# Altium project LPL_Control_board_Rev3.PrjPcb
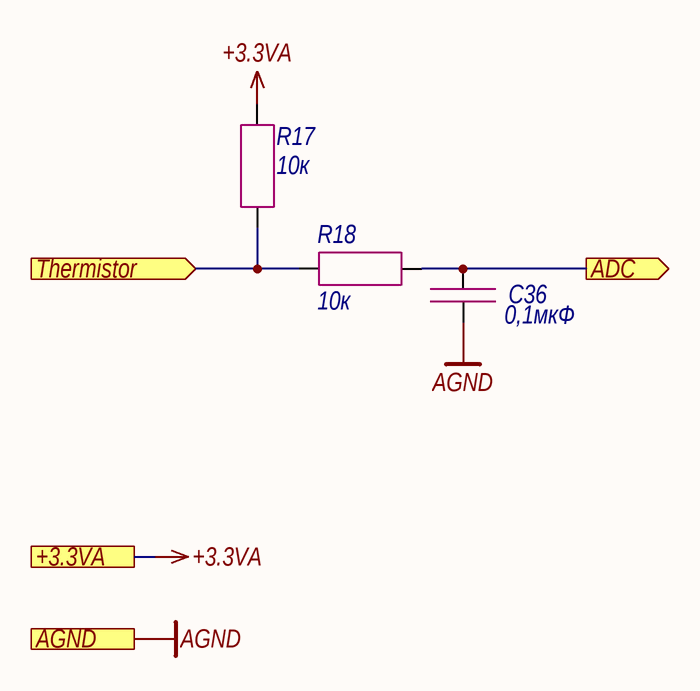
[diagram p0: Thermistor.SchDoc]
5 sheets, 105 parts. Net scope: strictly hierarchical (ports join the sheet entries above them; power ports are local).
Board file: PCB1.PcbDoc
Sheets:
  Thermistor.SchDoc
  LD_driver.SchDoc
  Fiber_interlock.SchDoc
  Ethernet.SchDoc
  Flow_sensor.SchDoc

## Sheet Thermistor.SchDoc
size 209 x 297 mm; Address1: Address1; Address2: Address2; Address3: Address3; Address4: Address4; DocumentNumber: *Э3; SheetNumber: 3; SheetTotal: 11; DocumentType: Схема электрическая *

### Parts
C36  0,1мкФ  [CAP_0603]
R17  10к  [RES_0603]
R18  10к  [RES_0603]

### Ports
+3.3VA (see Main[1B], Hardwiring[4D], LD_driver[1D], Photodiode[1C]), ADC (out, see Main[2B]), AGND (see Main[1B], Hardwiring[4D], LD_driver[1D], Photodiode[1D]), Thermistor (in, see Main[1B])

### Nets
+3.3VA: R17.1 ; port +3.3VA
AGND: C36.2 ; port AGND
NetC36_1: C36.1 R18.2 ; port ADC
NetR17_2: R17.2 R18.1 ; port Thermistor

### Notes on the sheet
- Подп. и дата
- Инв. № дубл.
- Взам. инв. №
- Инв. № подл.
- Изм.
- Лист
- № докум.
- Подп.
- Дата
- Копировал
- Формат А4

### Library data of the parts
C36 = Capacitor: Manufacturer: Murata; Model: GRM188R71H104KA93D; Value: 0,1мкФ; Document: *
R17 R18 = Resistor: Manufacturer: Yageo; Model: RC0603FR-0710KL; Value: 10к; Document: *

## Sheet LD_driver.SchDoc
size 420 x 297 mm; Address1: Address1; Address2: Address2; Address3: Address3; Address4: Address4; DocumentNumber: *Э3; SheetNumber: 5; SheetTotal: 11; DocumentType: Схема электрическая *
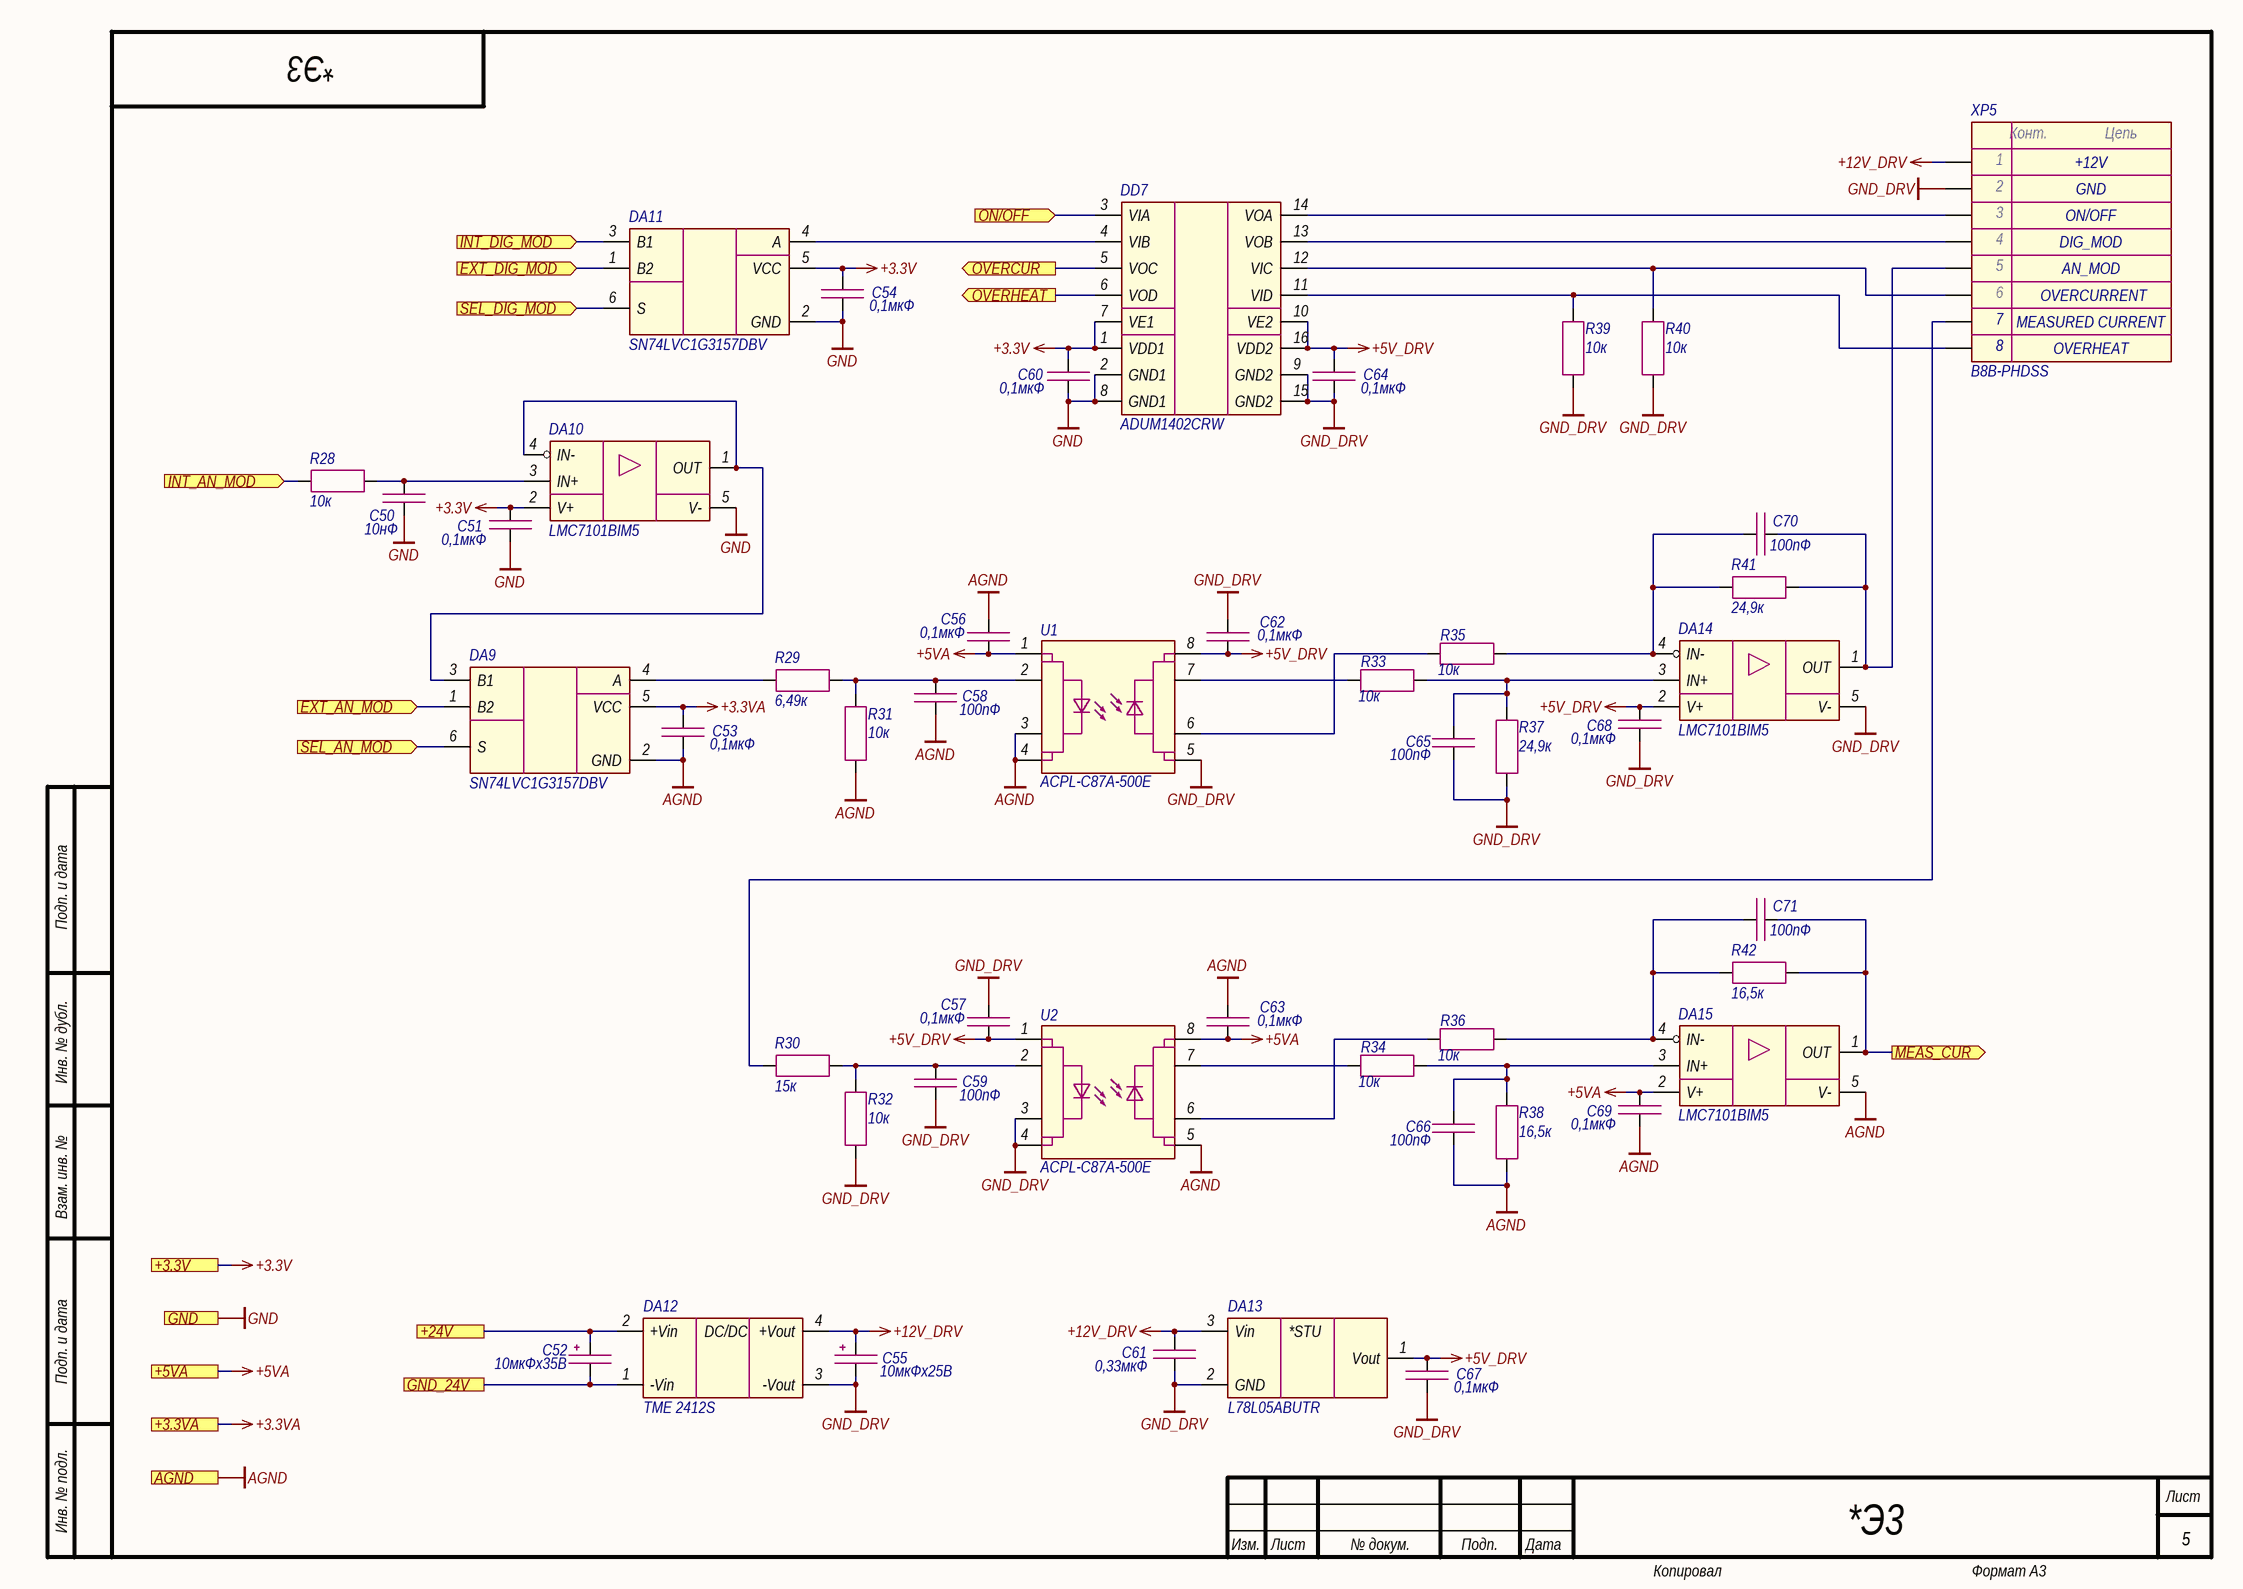
[diagram p1: LD_driver.SchDoc]

### Parts
C50  10нФ  [CAP_0603]
C51  0,1мкФ  [CAP_0603]
C52  10мкФх35B  [CAP_C]
C53  0,1мкФ  [CAP_0603]
C54  0,1мкФ  [CAP_0603]
C55  10мкФх25B  [CAP_C]
C56  0,1мкФ  [CAP_0603]
C57  0,1мкФ  [CAP_0603]
C58  100пФ  [CAP_0603]
C59  100пФ  [CAP_0603]
C60  0,1мкФ  [CAP_0603]
C61  0,33мкФ  [CAP_0805]
C62  0,1мкФ  [CAP_0603]
C63  0,1мкФ  [CAP_0603]
C64  0,1мкФ  [CAP_0603]
C65  100пФ  [CAP_0603]
C66  100пФ  [CAP_0603]
C67  0,1мкФ  [CAP_0603]
C68  0,1мкФ  [CAP_0603]
C69  0,1мкФ  [CAP_0603]
C70  100пФ  [CAP_0603]
C71  100пФ  [CAP_0603]
DA9  SN74LVC1G3157DBV  [SOT-23-6]
DA10  LMC7101BIM5  [SOT-23-5]
DA11  SN74LVC1G3157DBV  [SOT-23-6]
DA12  TME 2412S  [TME (SIP-4)]
DA13  L78L05ABUTR  [SOT-89]
DA14  LMC7101BIM5  [SOT-23-5]
DA15  LMC7101BIM5  [SOT-23-5]
DD7  ADUM1402CRW  [SOIC-16W]
R28  10к  [RES_0603]
R29  6,49к  [RES_0603]
R30  15к  [RES_0603]
R31  10к  [RES_0603]
R32  10к  [RES_0603]
R33  10к  [RES_0603]
R34  10к  [RES_0603]
R35  10к  [RES_0603]
R36  10к  [RES_0603]
R37  24,9к  [RES_0603]
R38  16,5к  [RES_0603]
R39  10к  [RES_0603]
R40  10к  [RES_0603]
R41  24,9к  [RES_0603]
R42  16,5к  [RES_0603]
U1  ACPL-C87A-500E  [SSO-8]
U2  ACPL-C87A-500E  [SSO-8]
XP5  B8B-PHDSS  [B8B-PHDSS]

### Ports
+3.3V (see Main[2C], Ethernet[3D], Fiber_interlock[2C], Flow_sensor[2C], Hardwiring[3D], Power_supply[1D]), +3.3VA (see Main[2C], Hardwiring[4D], Photodiode[1C], Thermistor[2C]), +5VA (see Main[2C], Hardwiring[3D], Photodiode[1C]), +24V (see Main[1C], Flow_sensor[2C], Hardwiring[3C], Indication[1C], Power_supply[1D]), AGND (see Main[2C], Hardwiring[4D], Photodiode[1D], Thermistor[2C]), EXT_AN_MOD (in, see Main[1C]), EXT_DIG_MOD (in, see Main[1C]), GND (see Main[2C], Ethernet[3D], Fiber_interlock[2C], Flow_sensor[2C], Guide_laser[1C], Hardwiring[3D], Indication[1C], Power_supply[1D]), GND_24V (see Main[1C], Flow_sensor[2C], Hardwiring[3C], Indication[1C], Power_supply[1D]), INT_AN_MOD (in, see Main[1C]), INT_DIG_MOD (in, see Main[1C]), MEAS_CUR (out, see Main[2C]), ON/OFF (in, see Main[1C]), OVERCUR (out, see Main[2C]), OVERHEAT (out, see Main[2C]), SEL_AN_MOD (in, see Main[1C]), SEL_DIG_MOD (in, see Main[1C])

### Nets
+3.3V: C51.1 C54.1 C60.1 DA10.2(V+) DA11.5(VCC) DD7.1(VDD1) DD7.7(VE1) ; port +3.3V
+3.3VA: C53.1 DA9.5(VCC) ; port +3.3VA
+5V_DRV: C57.1 C62.1 C64.1 C67.1 C68.1 DA13.1(Vout) DA14.2(V+) DD7.10(VE2) DD7.16(VDD2) U1.8(VDD2) U2.1(VDD1)
+5VA: C56.1 C63.1 C69.1 DA15.2(V+) U1.1(VDD1) U2.8(VDD2) ; port +5VA
+12V_DRV: C55.1 C61.2 DA12.4(+Vout) DA13.3(Vin) XP5.1
AGND: C53.2 C56.2 C58.1 C63.2 C66.2 C69.2 DA9.2(GND) DA15.5(V-) R31.2 R38.2 U1.3(SHDN) U1.4(GND1) U2.5(GND2) ; port AGND
GND: C50.2 C51.2 C54.2 C60.2 DA10.5(V-) DA11.2(GND) DD7.2(GND1) DD7.8(GND1) ; port GND
GND_DRV: C55.2 C57.2 C59.1 C61.1 C62.2 C64.2 C65.2 C67.2 C68.2 DA12.3(-Vout) DA13.2(GND) DA14.5(V-) DD7.9(GND2) DD7.15(GND2) R32.2 R37.1 R39.2 R40.2 U1.5(GND2) U2.3(SHDN) U2.4(GND1) XP5.2
NetC50_1: C50.1 DA10.3(IN+) R28.2
NetC52_1: C52.1 DA12.2(+Vin) ; port +24V
NetC52_2: C52.2 DA12.1(-Vin) ; port GND_24V
NetC58_2: C58.2 R29.1 R31.1 U1.2(VIN)
NetC59_2: C59.2 R30.1 R32.1 U2.2(VIN)
NetC65_1: C65.1 DA14.3(IN+) R33.2 R37.2
NetC66_1: C66.1 DA15.3(IN+) R34.2 R38.1
NetC70_1: C70.1 DA14.4(IN-) R35.2 R41.1
NetC70_2: C70.2 DA14.1(OUT) R41.2 XP5.5
NetC71_1: C71.1 DA15.4(IN-) R36.2 R42.2
NetC71_2: C71.2 DA15.1(OUT) R42.1 ; port MEAS_CUR
NetDA9_1: DA9.1(B2) ; port EXT_AN_MOD
NetDA9_3: DA9.3(B1) DA10.1(OUT) DA10.4(IN-)
NetDA9_4: DA9.4(A) R29.2
NetDA9_6: DA9.6(S) ; port SEL_AN_MOD
NetDA11_1: DA11.1(B2) ; port EXT_DIG_MOD
NetDA11_3: DA11.3(B1) ; port INT_DIG_MOD
NetDA11_4: DA11.4(A) DD7.4(VIB)
NetDA11_6: DA11.6(S) ; port SEL_DIG_MOD
NetDD7_3: DD7.3(VIA) ; port ON/OFF
NetDD7_5: DD7.5(VOC) ; port OVERCUR
NetDD7_6: DD7.6(VOD) ; port OVERHEAT
NetDD7_11: DD7.11(VID) R39.1 XP5.8
NetDD7_12: DD7.12(VIC) R40.1 XP5.6
NetDD7_13: DD7.13(VOB) XP5.4
NetDD7_14: DD7.14(VOA) XP5.3
NetR28_1: R28.1 ; port INT_AN_MOD
NetR30_2: R30.2 XP5.7
NetR33_1: R33.1 U1.7(VOUT+)
NetR34_1: R34.1 U2.7(VOUT+)
NetR35_1: R35.1 U1.6(VOUT-)
NetR36_1: R36.1 U2.6(VOUT-)

### Notes on the sheet
- +12V
- GND
- ON/OFF
- DIG_MOD
- (near XP5) MEASURED CURRENT
- AN_MOD
- OVERCURRENT
- OVERHEAT
- Подп. и дата
- Инв. № дубл.
- Взам. инв. №
- Инв. № подл.
- Изм.
- Лист
- № докум.
- Подп.
- Дата
- Копировал
- Формат А3
- (in symbol Connector-8) Конт.; Цепь
- (in symbol LD2981ABU50TR) *STU
- (in symbol TME) DC/DC

### Library data of the parts
C50 = Capacitor: Manufacturer: Murata; Model: GRM188R71H103JA01D; Value: 10нФ; Document: *
C51 C53 C54 C56 C57 C60 C62-C64 C67-C69 = Capacitor: as C36 on sheet Thermistor; Value: 0,1мкФ; Document: *
C52 = Capacitor_Polar: Model: TECAP, 10 мкФ, 35 В, тип C, 10%; Value: 10мкФх35B; Document: *; Manufacturer: *
C55 = Capacitor_Polar: Model: TECAP, 10 мкФ, 25 В, тип B, 10%; Value: 10мкФх25B; Document: *; Manufacturer: *
C58 C59 C65 C66 C70 C71 = Capacitor: Manufacturer: Murata; Model: GRM1885C1H101JA01D; Value: 100пФ; Document: *
C61 = Capacitor: Manufacturer: Murata; Model: GRM219R71H334KA88D; Value: 0,33мкФ; Document: *
DA9 DA11 = SN74LVC1G3157: Manufacturer: Texas Instruments; Model: SN74LVC1G3157DBV; Document: *
DA10 DA14 DA15 = LMC7101: Manufacturer: Texas Instruments; Model: LMC7101BIM5; Document: *
DA12 = TME: Manufacturer: Traco Power; Model: TME 2412S; Document: *
DA13 = LD2981ABU50TR: Manufacturer: STMicroelectronics; Model: L78L05ABUTR; Document: *
DD7 = ADUM1402: Manufacturer: Analog Devices; Model: ADUM1402CRW; Document: *
R28 R31-R36 R39 R40 = Resistor: as R17 on sheet Thermistor; Value: 10к; Document: *
R29 = Resistor: Manufacturer: Yageo; Model: RC0603FR-076K49L; Value: 6,49к; Document: *
R30 = Resistor: Manufacturer: Yageo; Model: RC0603FR-0715KL; Value: 15к; Document: *
R37 R41 = Resistor: Manufacturer: Yageo; Model: RC0603FR-0724K9L; Value: 24,9к; Document: *
R38 R42 = Resistor: Manufacturer: Yageo; Model: RC0603FR-0716K5L; Value: 16,5к; Document: *
U1 U2 = ACPL-C87: Manufacturer: Broadcom; Model: ACPL-C87A-500E
XP5 = Connector-8: Manufacturer: JST; Model: B8B-PHDSS; Document: *

## Sheet Fiber_interlock.SchDoc
size 420 x 297 mm; Address1: Address1; Address2: Address2; Address3: Address3; Address4: Address4; DocumentNumber: *Э3; SheetNumber: 8; SheetTotal: 11; DocumentType: Схема электрическая *
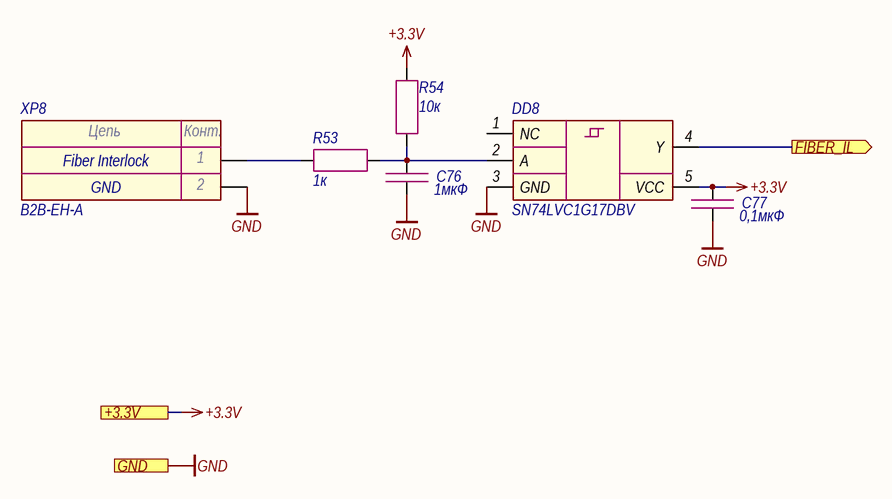
[diagram p2: Fiber_interlock.SchDoc]

### Parts
C76  1мкФ  [CAP_0603]
C77  0,1мкФ  [CAP_0603]
DD8  SN74LVC1G17DBV  [SOT-23-5]
R53  1к  [RES_0603]
R54  10к  [RES_0603]
XP8  B2B-EH-A  [B2B-EH-A]

### Ports
+3.3V (see Main[2A], Ethernet[3D], Flow_sensor[2C], Hardwiring[3D], LD_driver[1D], Power_supply[1D]), FIBER_IL (out, see Main[3A]), GND (see Main[2A], Ethernet[3D], Flow_sensor[2C], Guide_laser[1C], Hardwiring[3D], Indication[1C], LD_driver[1D], Power_supply[1D])

### Nets
+3.3V: C77.1 DD8.5(VCC) R54.2 ; port +3.3V
GND: C76.2 C77.2 DD8.3(GND) XP8.2 ; port GND
NetC76_1: C76.1 DD8.2(A) R53.2 R54.1
NetDD8_4: DD8.4(Y) ; port FIBER_IL
NetR53_1: R53.1 XP8.1

Not connected (* = marked no-connect by the designer): DD8 1(NC)

### Notes on the sheet
- (near XP8) Fiber Interlock
- GND
- Подп. и дата
- Инв. № дубл.
- Взам. инв. №
- Инв. № подл.
- Изм.
- Лист
- № докум.
- Подп.
- Дата
- Копировал
- Формат А3
- (in symbol Connector-2) Цепь; Конт.

### Library data of the parts
C76 = Capacitor: Manufacturer: Murata; Model: GRM188R61H105KAALD; Value: 1мкФ; Document: *
C77 = Capacitor: as C36 on sheet Thermistor; Value: 0,1мкФ; Document: *
DD8 = SN74LVC1G17: Manufacturer: Texas Instruments; Model: SN74LVC1G17DBV; Document: *
R53 = Resistor: Manufacturer: Yageo; Model: RC0603FR-071KL; Value: 1к; Document: *
R54 = Resistor: as R17 on sheet Thermistor; Value: 10к; Document: *
XP8 = Connector-2: Manufacturer: JST; Model: B2B-EH-A; Document: *

## Sheet Ethernet.SchDoc
size 420 x 297 mm; Address1: Address1; Address2: Address2; Address3: Address3; Address4: Address4; DocumentNumber: *Э3; SheetNumber: 9; SheetTotal: 11; DocumentType: Схема электрическая *
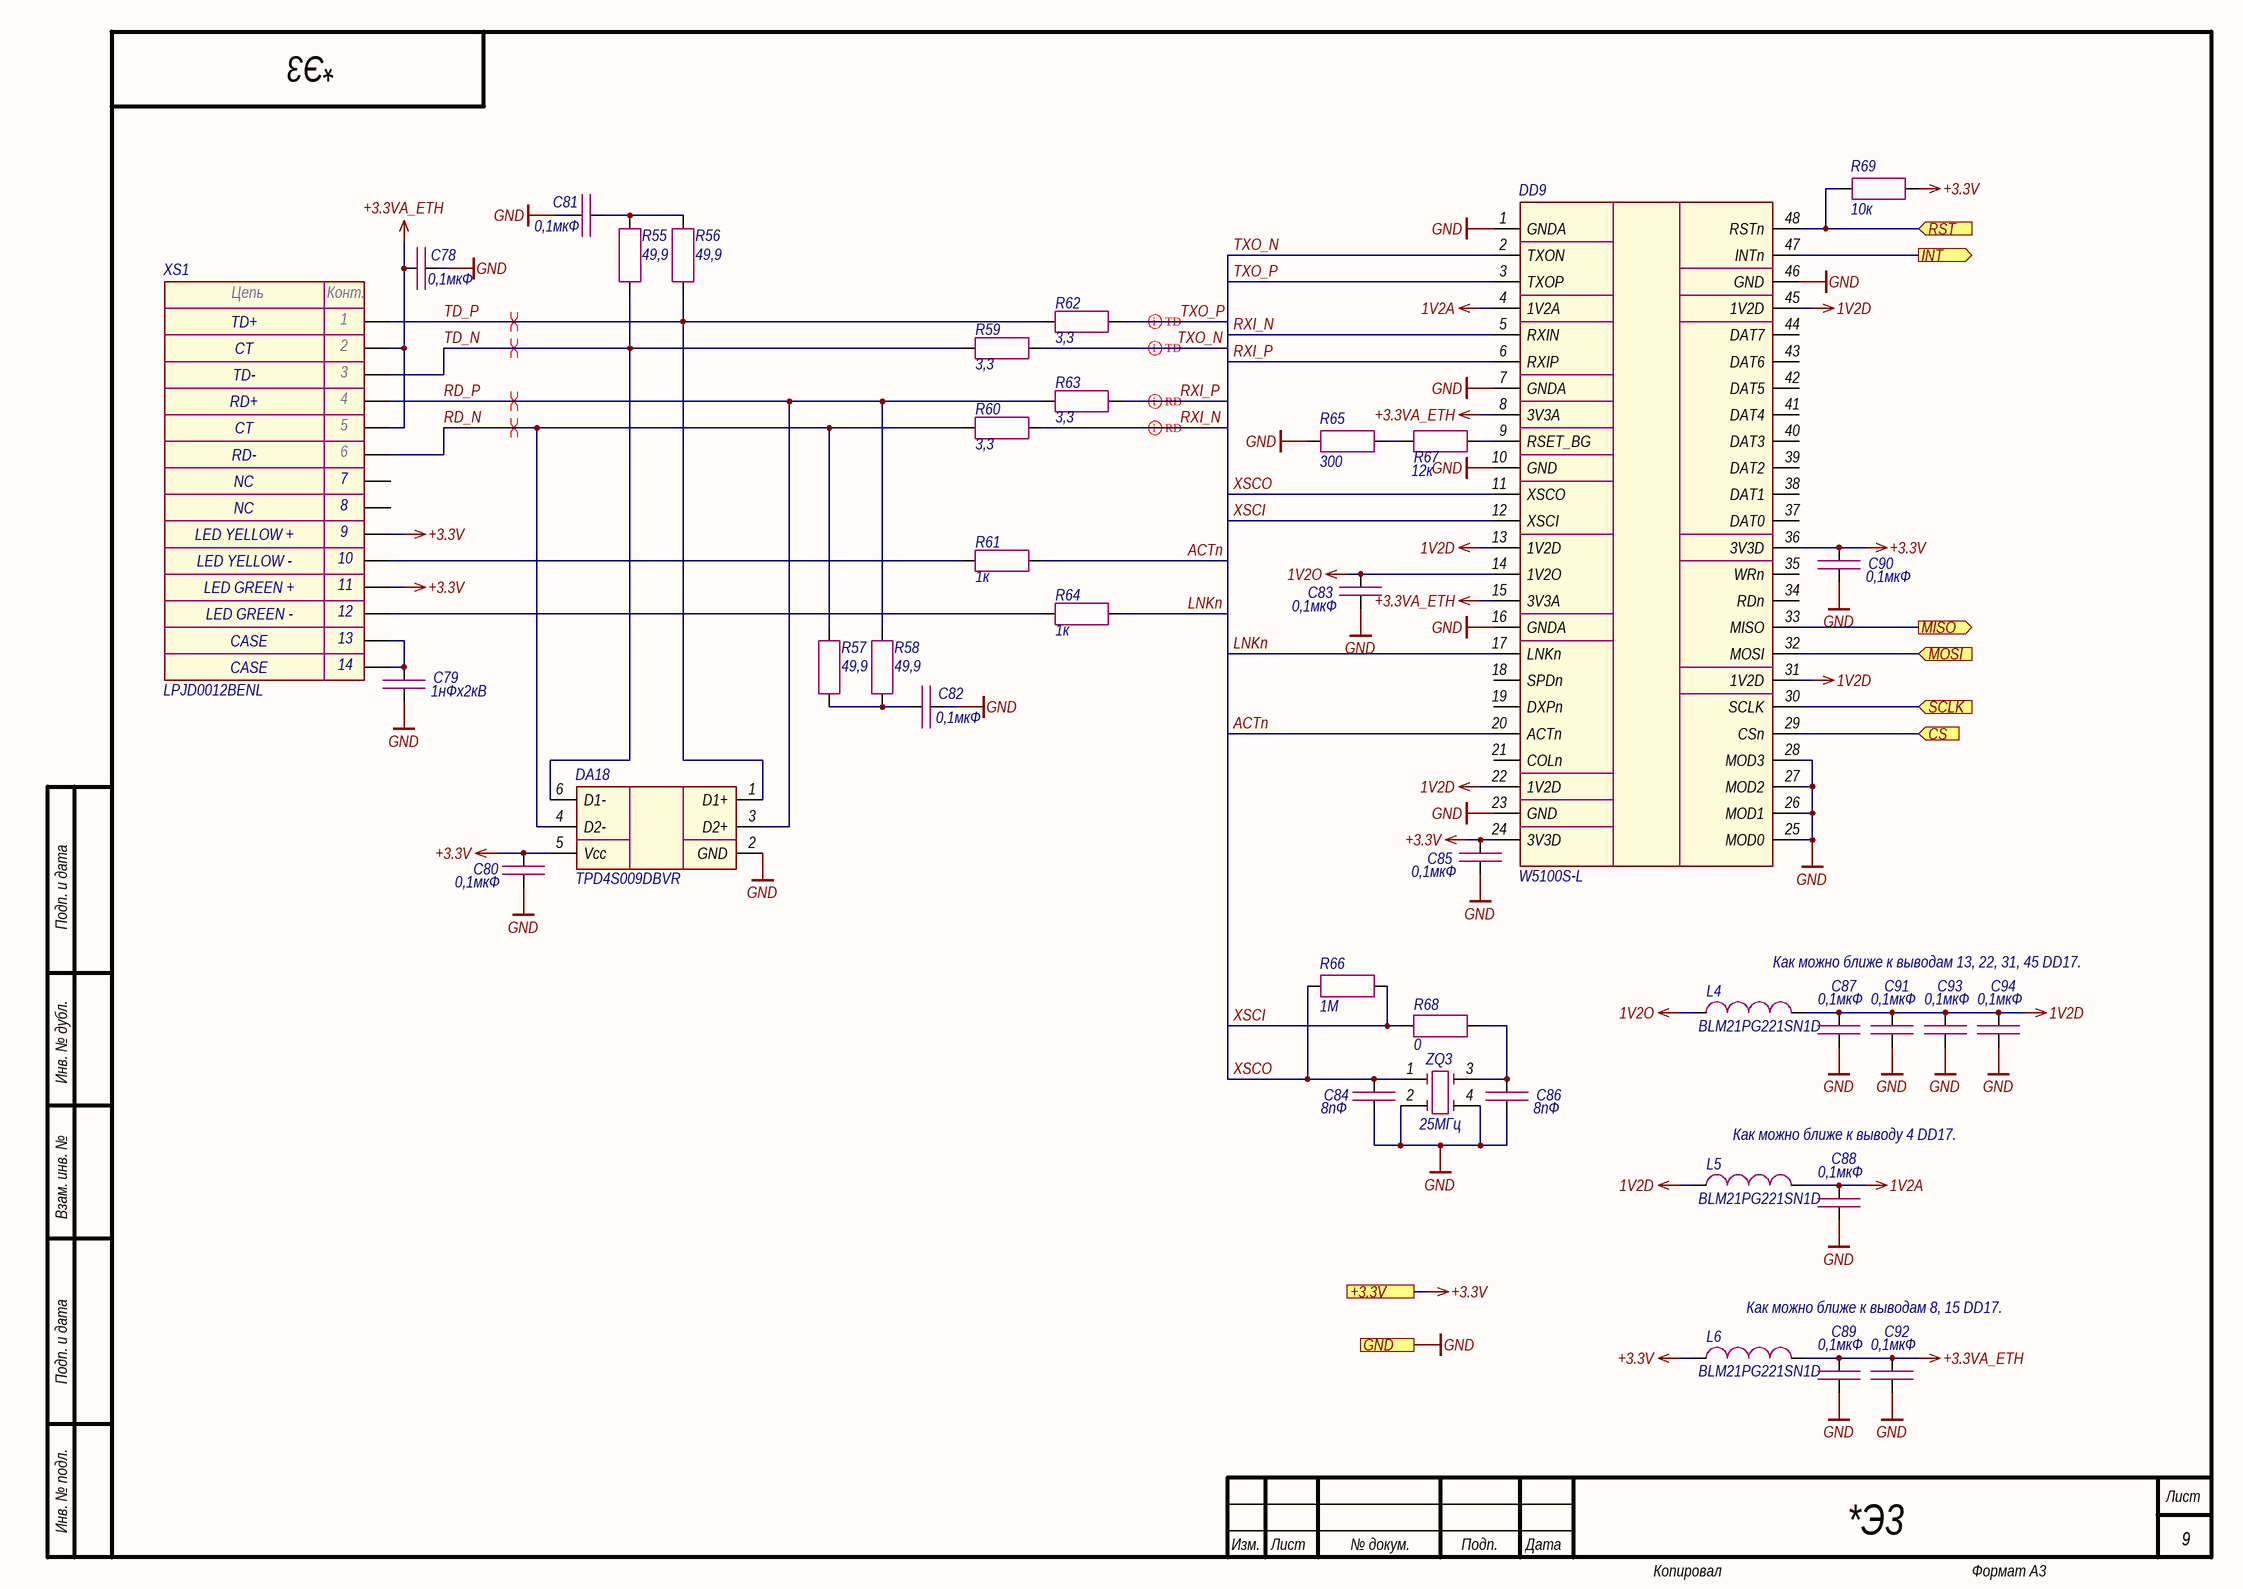
[diagram p3: Ethernet.SchDoc]

### Parts
C78  0,1мкФ  [CAP_0603]
C79  1нФх2кВ  [CAP_1206]
C80  0,1мкФ  [CAP_0603]
C81  0,1мкФ  [CAP_0603]
C82  0,1мкФ  [CAP_0603]
C83  0,1мкФ  [CAP_0603]
C84  8пФ  [CAP_0603]
C85  0,1мкФ  [CAP_0603]
C86  8пФ  [CAP_0603]
C87  0,1мкФ  [CAP_0603]
C88  0,1мкФ  [CAP_0603]
C89  0,1мкФ  [CAP_0603]
C90  0,1мкФ  [CAP_0603]
C91  0,1мкФ  [CAP_0603]
C92  0,1мкФ  [CAP_0603]
C93  0,1мкФ  [CAP_0603]
C94  0,1мкФ  [CAP_0603]
DA18  TPD4S009DBVR  [SOT-23-6]
DD9  W5100S-L  [LQFP-48]
L4  BLM21PG221SN1D  [IND_0805]
L5  BLM21PG221SN1D  [IND_0805]
L6  BLM21PG221SN1D  [IND_0805]
R55  49,9  [RES_0603]
R56  49,9  [RES_0603]
R57  49,9  [RES_0603]
R58  49,9  [RES_0603]
R59  3,3  [RES_0603]
R60  3,3  [RES_0603]
R61  1к  [RES_0603]
R62  3,3  [RES_0603]
R63  3,3  [RES_0603]
R64  1к  [RES_0603]
R65  300  [RES_0603]
R66  1М  [RES_0603]
R67  12к  [RES_0603]
R68  0  [RES_0603]
R69  10к  [RES_0603]
XS1  LPJD0012BENL  [LPJD0012BENL]
ZQ3  25МГц  [7M]

### Ports
+3.3V (see Main[3B], Fiber_interlock[2C], Flow_sensor[2C], Hardwiring[3D], LD_driver[1D], Power_supply[1D]), CS (in, see Main[2B]), GND (see Main[3B], Fiber_interlock[2C], Flow_sensor[2C], Guide_laser[1C], Hardwiring[3D], Indication[1C], LD_driver[1D], Power_supply[1D]), INT (out, see Main[3B]), MISO (out, see Main[2B]), MOSI (in, see Main[2B]), RST (in, see Main[3B]), SCLK (in, see Main[2B])

### Nets
1V2A: C88.1 DD9.4(1V2A) L5.2
1V2D: C87.1 C91.1 C93.1 C94.1 DD9.13(1V2D) DD9.22(1V2D) DD9.31(1V2D) DD9.45(1V2D) L4.2 L5.1
1V2O: C83.1 DD9.14(1V2O) L4.1
+3.3V: C80.1 C85.1 C90.1 DA18.5(Vcc) DD9.24(3V3D) DD9.36(3V3D) L6.1 R69.2 XS1.9 XS1.11 ; port +3.3V
+3.3VA_ETH: C78.1 C89.1 C92.1 DD9.8(3V3A) DD9.15(3V3A) L6.2 XS1.2 XS1.5
GND: C78.2 C79.2 C80.2 C81.2 C82.2 C83.2 C84.2 C85.2 C86.2 C87.2 C88.2 C89.2 C90.2 C91.2 C92.2 C93.2 C94.2 DA18.2(GND) DD9.1(GNDA) DD9.7(GNDA) DD9.10(GND) DD9.16(GNDA) DD9.23(GND) DD9.25(MOD0) DD9.26(MOD1) DD9.27(MOD2) DD9.28(MOD3) DD9.46(GND) R65.1 ZQ3.2 ZQ3.4 ; port GND
ACTn: DD9.20(ACTn) R61.2
LNKn: DD9.17(LNKn) R64.2
RD_N: DA18.4(D2-) R57.1 R60.2 XS1.6
RD_P: DA18.3(D2+) R58.1 R63.2 XS1.4
RXI_N: DD9.5(RXIN) R60.1
RXI_P: DD9.6(RXIP) R63.1
TD_N: DA18.6(D1-) R55.1 R59.2 XS1.3
TD_P: DA18.1(D1+) R56.1 R62.2 XS1.1
TXO_N: DD9.2(TXON) R59.1
TXO_P: DD9.3(TXOP) R62.1
XSCI: DD9.12(XSCI) R66.2 R68.1
XSCO: C84.1 DD9.11(XSCO) R66.1 ZQ3.1
NetC79_1: C79.1 XS1.13 XS1.14
NetC81_1: C81.1 R55.2 R56.2
NetC82_1: C82.1 R57.2 R58.2
NetC86_1: C86.1 R68.2 ZQ3.3
NetDD9_9: DD9.9(RSET_BG) R67.2
NetDD9_29: DD9.29(CSn) ; port CS
NetDD9_30: DD9.30(SCLK) ; port SCLK
NetDD9_32: DD9.32(MOSI) ; port MOSI
NetDD9_33: DD9.33(MISO) ; port MISO
NetDD9_47: DD9.47(INTn) ; port INT
NetDD9_48: DD9.48(RSTn) R69.1 ; port RST
NetR61_1: R61.1 XS1.10
NetR64_1: R64.1 XS1.12
NetR65_2: R65.2 R67.1

Not connected (* = marked no-connect by the designer): DD9 18(SPDn) 19(DXPn) 21(COLn) 34(RDn) 35(WRn) 37(DAT0) 38(DAT1) 39(DAT2) 40(DAT3) 41(DAT4) 42(DAT5) 43(DAT6) 44(DAT7); XS1 7 8

### Layout directives
differential pair; differential pair class TD: TXO_N, TXO_P
differential pair; differential pair class RD: RXI_N, RXI_P
differential pair: RD_N, RD_P, TD_N, TD_P

### Notes on the sheet
- Как можно ближе к выводам 13, 22, 31, 45 DD17.
- Как можно ближе к выводу 4 DD17.
- Как можно ближе к выводам 8, 15 DD17.
- Подп. и дата
- Инв. № дубл.
- Взам. инв. №
- Инв. № подл.
- Изм.
- Лист
- № докум.
- Подп.
- Дата
- Копировал
- Формат А3
- (in symbol LPJD0012BENL) Цепь; Конт.; TD+; CT; TD-; RD+; RD-; NC; LED YELLOW +; LED YELLOW -; LED GREEN +; LED GREEN -; CASE

### Library data of the parts
C78 C80-C83 C85 C87-C94 = Capacitor: as C36 on sheet Thermistor; Value: 0,1мкФ; Document: *
C79 = Capacitor: Manufacturer: Yageo; Model: CC1206KKX7RDBB102; Value: 1нФх2кВ; Document: *
C84 C86 = Capacitor: Manufacturer: Yageo; Model: CC0603CRNPO9BN8R0; Value: 8пФ; Document: *
DA18 = TPD4S009: Manufacturer: Texas Instruments; Model: TPD4S009DBVR; Document: *
DD9 = W5100S: Manufacturer: Wiznet; Model: W5100S-L; Document: *
L4-L6 = Inductor: Manufacturer: Murata; Value: *; Model: BLM21PG221SN1D; Document: *
R55-R58 = Resistor: Manufacturer: Yageo; Model: RC0603FR-0749R9L; Value: 49,9; Document: *
R59 R60 R62 R63 = Resistor: Manufacturer: Yageo; Model: RC0603FR-073R3L; Value: 3,3; Document: *
R61 R64 = Resistor: as R53 on sheet Fiber_interlock; Value: 1к; Document: *
R65 = Resistor: Manufacturer: Yageo; Model: RC0603FR-07300RL; Value: 300; Document: *
R66 = Resistor: Manufacturer: Yageo; Model: RC0603FR-071ML; Value: 1М; Document: *
R67 = Resistor: Manufacturer: Yageo; Model: RC0603FR-0712KL; Value: 12к; Document: *
R68 = Resistor: Manufacturer: Yageo; Model: RC0603FR-070RL; Value: 0; Document: *
R69 = Resistor: as R17 on sheet Thermistor; Value: 10к; Document: *
XS1 = LPJD0012BENL: Manufacturer: LINK-PP; Model: LPJD0012BENL; Document: *
ZQ3 = Quartz_Resonator_4-pin: Manufacturer: TXC; Model: 7M-25.000MAAJ-T; Value: 25МГц; Document: *

## Sheet Flow_sensor.SchDoc
size 420 x 297 mm; Address1: Address1; Address2: Address2; Address3: Address3; Address4: Address4; DocumentNumber: *Э3; SheetNumber: 11; SheetTotal: 11; DocumentType: Схема электрическая *
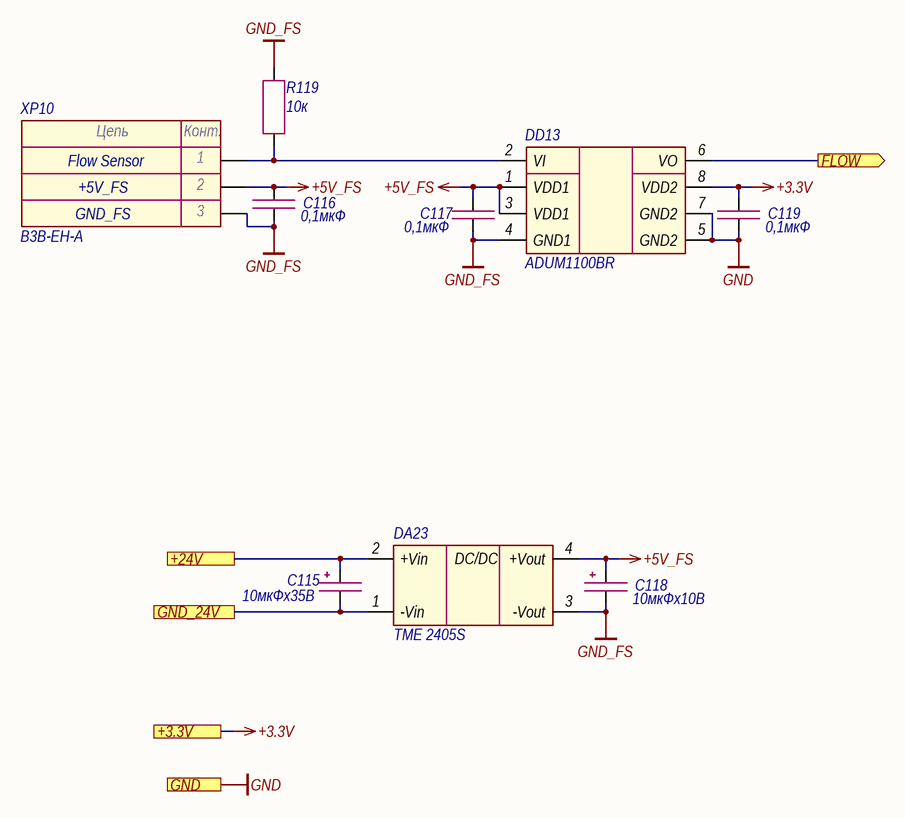
[diagram p4: Flow_sensor.SchDoc]

### Parts
C115  10мкФх35B  [CAP_C]
C116  0,1мкФ  [CAP_0603]
C117  0,1мкФ  [CAP_0603]
C118  10мкФх10B  [CAP_A]
C119  0,1мкФ  [CAP_0603]
DA23  TME 2405S  [TME (SIP-4)]
DD13  ADUM1100BR  [SOIC-8]
R119  10к  [RES_0603]
XP10  B3B-EH-A  [B3B-EH-A]

### Ports
+3.3V (see Main[3C], Ethernet[3D], Fiber_interlock[2C], Hardwiring[3D], LD_driver[1D], Power_supply[1D]), +24V (see Main[2C], Hardwiring[3C], Indication[1C], LD_driver[1D], Power_supply[1D]), FLOW (out, see Main[3C]), GND (see Main[3C], Ethernet[3D], Fiber_interlock[2C], Guide_laser[1C], Hardwiring[3D], Indication[1C], LD_driver[1D], Power_supply[1D]), GND_24V (see Main[2C], Hardwiring[3C], Indication[1C], LD_driver[1D], Power_supply[1D])

### Nets
+3.3V: C119.1 DD13.8(VDD2) ; port +3.3V
+5V_FS: C116.1 C117.1 C118.1 DA23.4(+Vout) DD13.1(VDD1) DD13.3(VDD1) XP10.2
GND: C119.2 DD13.5(GND2) DD13.7(GND2) ; port GND
GND_FS: C116.2 C117.2 C118.2 DA23.3(-Vout) DD13.4(GND1) R119.2 XP10.3
NetC115_1: C115.1 DA23.2(+Vin) ; port +24V
NetC115_2: C115.2 DA23.1(-Vin) ; port GND_24V
NetDD13_2: DD13.2(VI) R119.1 XP10.1
NetDD13_6: DD13.6(VO) ; port FLOW

### Notes on the sheet
- +5V_FS
- Flow Sensor
- GND_FS
- Подп. и дата
- Инв. № дубл.
- Взам. инв. №
- Инв. № подл.
- Изм.
- Лист
- № докум.
- Подп.
- Дата
- Копировал
- Формат А3
- (in symbol Connector-3) Цепь; Конт.
- (in symbol TME) DC/DC

### Library data of the parts
C115 = Capacitor_Polar: Model: TECAP, 10 мкФ, 35 В, тип C, 10%; Value: 10мкФх35B; Document: *; Manufacturer: *
C116 C117 C119 = Capacitor: as C36 on sheet Thermistor; Value: 0,1мкФ; Document: *
C118 = Capacitor_Polar: Model: TECAP, 10 мкФ, 10 В, тип A, 10%; Value: 10мкФх10B; Document: *; Manufacturer: *
DA23 = TME: Manufacturer: Traco Power; Model: TME 2405S; Document: *
DD13 = ADUM1100: Manufacturer: Analog Devices; Model: ADUM1100BR; Document: *
R119 = Resistor: as R17 on sheet Thermistor; Value: 10к; Document: *
XP10 = Connector-3: Manufacturer: JST; Model: B3B-EH-A; Document: *